# EAGLE design pico_tracker_v3.1 (EAGLE 6.4)
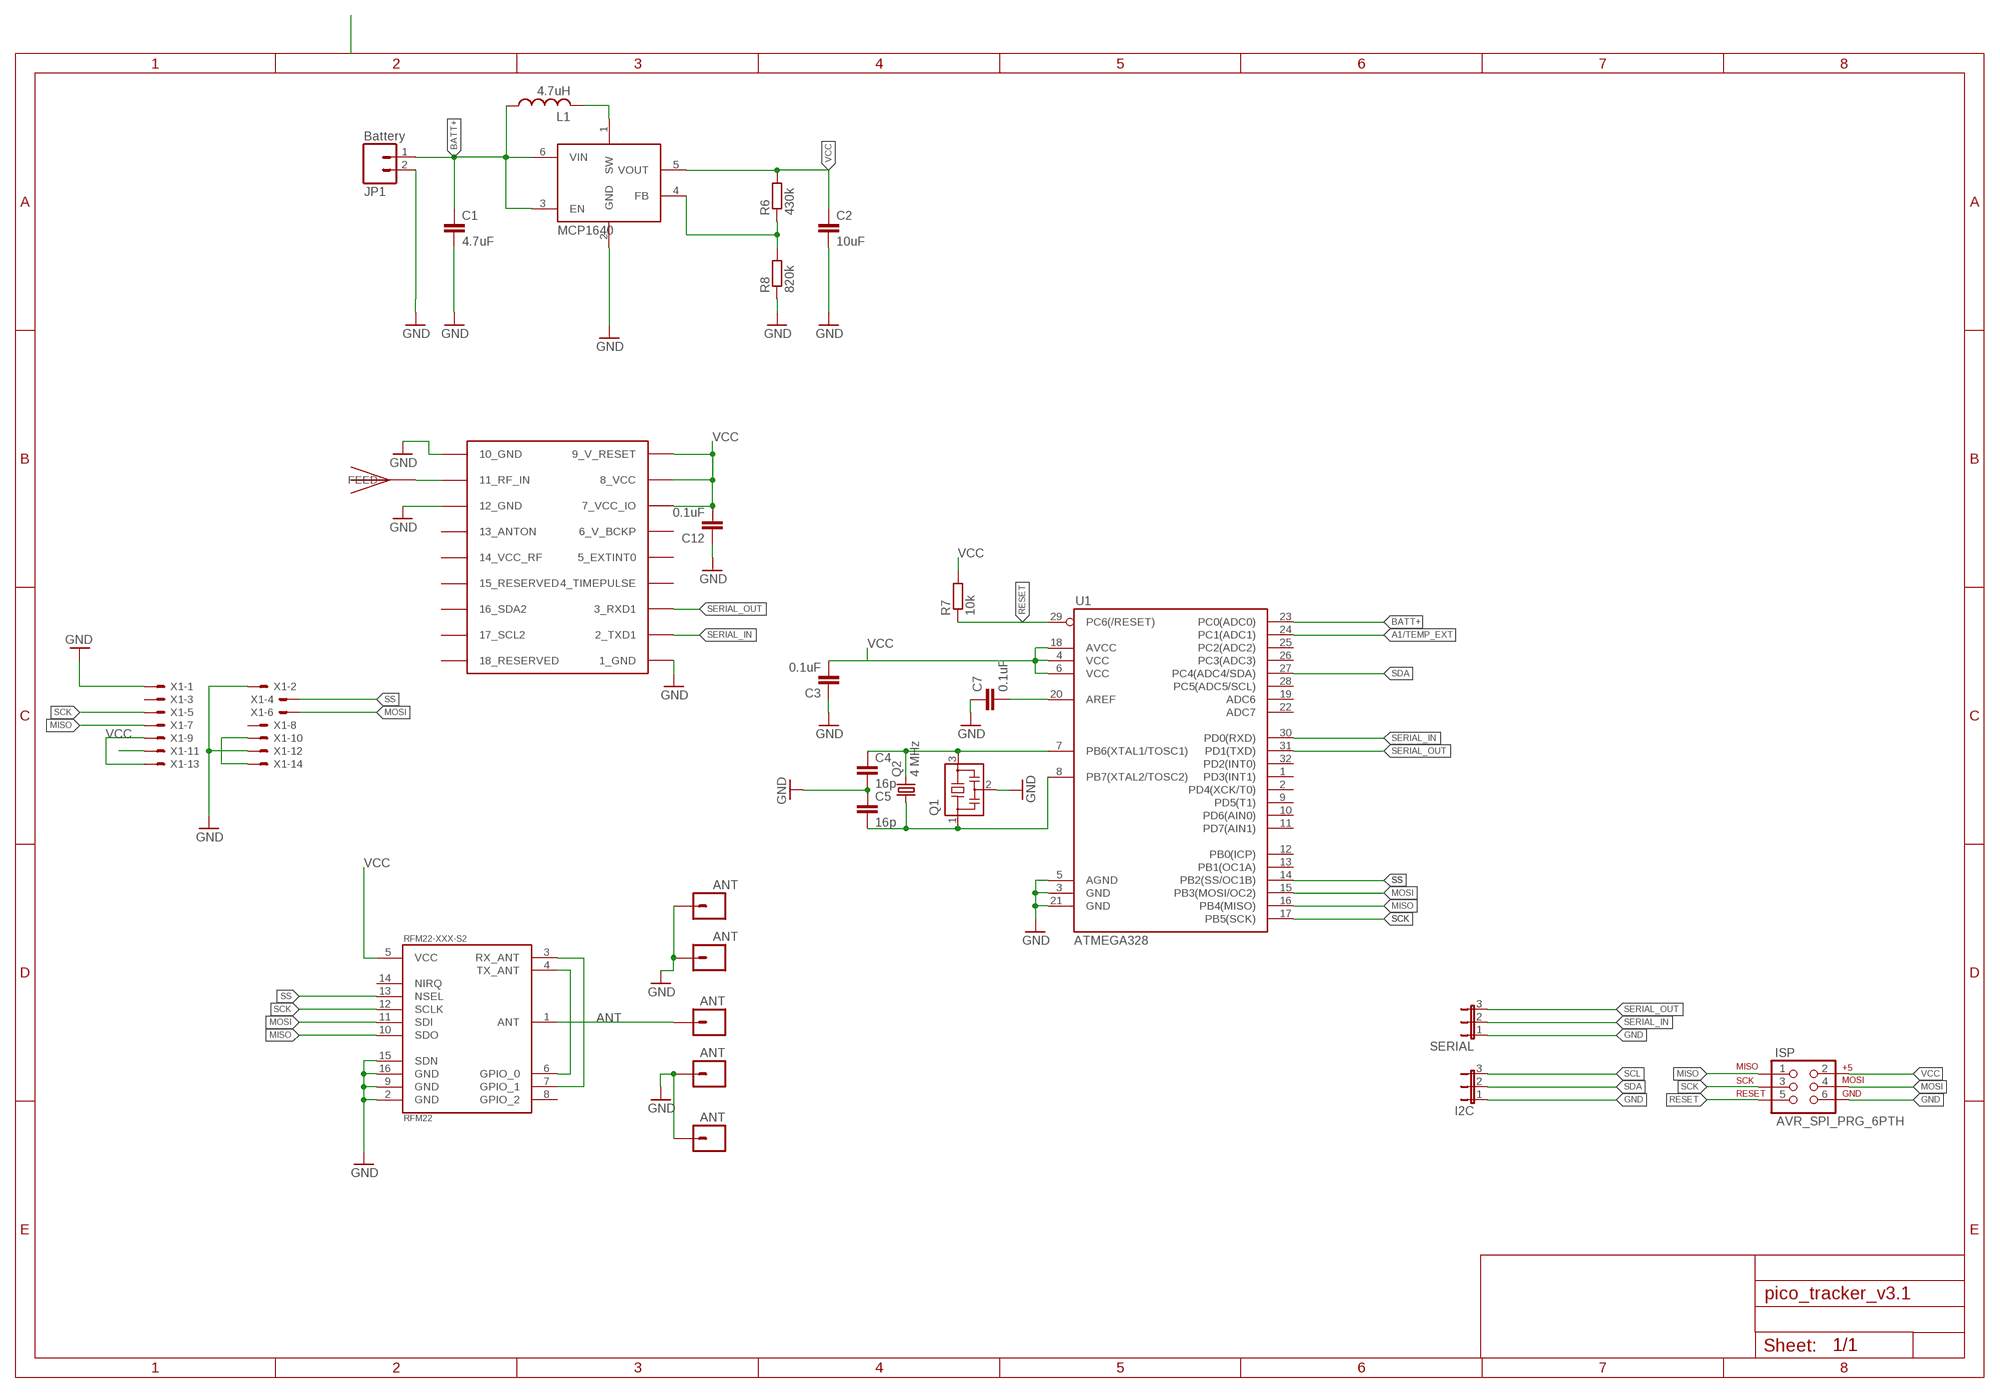
[diagram p0: schematic, sheet 1]

## Parts
C1  4.7uF  C-EUC0805  [C0805]
C2  10uF  C-EUC0805  [C0805]
C3  0.1uF  C-EUC0603  [C0603]
C4  16p  C-EUC0603  [C0603]
C5  16p  C-EUC0603  [C0603]
C7  0.1uF  C-EUC0603  [C0603]
C12  0.1uF  C-EUC0603  [C0603]
GND  ANT  M01PTH  [1X01]
GND17  ANT  M01PTH  [1X01]
GPS_ANT  JTI_ANTENNA-1575AT43A40  [JTI_ANTENNA-1575AT43A40]
I2C  JP2E  [JP2]
ISP  AVR_SPI_PRG_6PTH  [2X3]
JP1  Battery  M02PTH  [1X02]
JP2  ANT  M01PTH  [1X01]
JP3  ANT  M01PTH  [1X01]
JP4  ANT  M01PTH  [1X01]
L1  4.7uH  LLQH44P_P0  [LQH44]
Q1  CSTCR6M00G53Z  [CSTCR6M]
Q2  4 MHz  ABRACON_ABM3_CRYSTALABM03_HC49  [ABM03_HC49]
R6  430k  R-EU_R0603  [R0603]
R7  10k  R-EU_R0603  [R0603]
R8  820k  R-EU_R0603  [R0603]
RFM22-XXX-S2  RFM22  [RFM22-XXX-S2]
SERIAL  JP2E  [JP2]
U1  ATMEGA328  ATMEGA168  [TQFP32-08]
U2  MCP1640  [SOT23-6]
U$3  UBLOX_MAX-6  [UBLOX_MAX-6]
X1  87758-1416  [87758-1416]

## Nets
A1/TEMP_EXT: U1.24(PC1(ADC1))
ANT: JP2.1 RFM22-XXX-S2.1(ANT)
AREF: C7.2 U1.20(AREF)
BATT+ [vcc]: C1.1 JP1.1 L1.P$1 U1.23(PC0(ADC0)) U2.3(EN) U2.6(VIN)
GND: C1.2 C2.2 C3.1 C4.2 C5.1 C7.1 C12.1 GND17.1 GND.1 I2C.1 ISP.6 JP1.2 JP3.1 JP4.1 Q1.2 R8.1 RFM22-XXX-S2.2(GND) RFM22-XXX-S2.9(GND) RFM22-XXX-S2.15(SDN) RFM22-XXX-S2.16(GND) SERIAL.1 U1.3(GND) U1.5(AGND) U1.21(GND) U2.2(GND) U$3.1_GND U$3.10_GND U$3.12_GND X1.1 X1.2 X1.12
GPS_ANT: GPS_ANT.FEED U$3.11_RF_IN
MISO: ISP.1 RFM22-XXX-S2.10(SDO) U1.16(PB4(MISO)) X1.7
MOSI: ISP.4 RFM22-XXX-S2.11(SDI) U1.15(PB3(MOSI/OC2)) X1.6
N$2: X1.9 X1.13
N$3: X1.10 X1.14
N$6: RFM22-XXX-S2.4(TX_ANT) RFM22-XXX-S2.6(GPIO_0)
N$7: RFM22-XXX-S2.3(RX_ANT) RFM22-XXX-S2.7(GPIO_1)
N$8: L1.P$2 U2.1(SW)
N$9: C4.1 Q1.3 Q2.2 U1.7(PB6(XTAL1/TOSC1))
N$10: C5.2 Q1.1 Q2.1 U1.8(PB7(XTAL2/TOSC2))
N$11: R6.1 R8.2 U2.4(FB)
RESET: ISP.5 R7.1 U1.29(PC6(/RESET))
SCK: ISP.3 RFM22-XXX-S2.12(SCLK) U1.17(PB5(SCK)) X1.5
SCL: I2C.3
SDA: I2C.2 U1.27(PC4(ADC4/SDA))
SERIAL_IN: SERIAL.2 U1.30(PD0(RXD)) U$3.2_TXD1
SERIAL_OUT: SERIAL.3 U1.31(PD1(TXD)) U$3.3_RXD1
SS: RFM22-XXX-S2.13(NSEL) U1.14(PB2(SS/OC1B)) X1.4
VCC: C2.1 C3.2 C12.2 ISP.2 R6.2 R7.2 RFM22-XXX-S2.5(VCC) U1.4(VCC) U1.6(VCC) U1.18(AVCC) U2.5(VOUT) U$3.7_VCC_IO U$3.8_VCC U$3.9_V_RESET X1.11
Unconnected: RFM22-XXX-S2.8(GPIO_2) RFM22-XXX-S2.14(NIRQ) U1.1(PD3(INT1)) U1.2(PD4(XCK/T0)) U1.9(PD5(T1)) U1.10(PD6(AIN0)) U1.11(PD7(AIN1)) U1.12(PB0(ICP)) U1.13(PB1(OC1A)) U1.19(ADC6) U1.22(ADC7) U1.25(PC2(ADC2)) U1.26(PC3(ADC3)) U1.28(PC5(ADC5/SCL)) U1.32(PD2(INT0)) U$3.4_TIMEPULSE U$3.5_EXTINT0 U$3.6_V_BCKP U$3.13_ANTON U$3.14_VCC_RF U$3.15_RESERVED U$3.16_SDA2 U$3.17_SCL2 U$3.18_RESERVED X1.3 X1.8

## Library data of the parts
C1-C5 C7 C12 = resistor:C-EU: CAPACITOR, European symbol
GND GND17 JP2-JP4 = SparkFun:M01: Header 1 Standard 1-pin 0.1" header. Use with straight break away headers (SKU : PRT-00116), right angle break away headers (PRT-00553), swiss pins (PRT-00743), machine pins (PRT-00117), and female headers (PRT-00115).
GPS_ANT = ava:JTI_ANTENNA-1575AT43A40
I2C SERIAL = jumper:JP2E: JUMPER
ISP = SparkFun:AVR_SPI_PRG_6: AVR ISP 6 Pin This is the reduced ISP connector for AVR programming. Common on Arduino. This footprint will take up less PCB space and can be used with a 10-pin to 6-pin adapter such as SKU: BOB-08508
JP1 = SparkFun:M02: Header 2 Standard 2-pin 0.1" header. Use with straight break away headers (SKU : PRT-00116), right angle break away headers (PRT-00553), swiss pins (PRT-00743), machine pins (PRT-00117), and female headers (PRT-00115). Molex polarized connector foot print use with SKU : PRT-08233 with associated crimp pins and housings.
L1 = karlnet-parts:L
Q1 = murata-filter:CSTCR: Resonator Source: murata.co.jp; MPN: CSTCR6M00G53-R0; OC_FARNELL: 1170434; OC_NEWARK: 25M8759
Q2 = ava:ABRACON_ABM3_CRYSTAL
R6-R8 = resistor:R-EU_: RESISTOR, European symbol
RFM22-XXX-S2 = SparkFun:RFM22: *Hope RF's RFM22* Packages: RFM22-S2 (SMD)
U1 = SparkFun:ATMEGA168
U2 = karlnet-parts:MCP1640: MCP1623, 1624, 1640/B/C/D pwm/pfm or pwm only DC/DC converters, in SOT-23
U$3 = ava:UBLOX_MAX-6: UBLOX MAX-6
X1 = con-molex:87758-1416: 14 Pin - 2mm Dual Row Single Wafer, Vertical T/H HDR Source: http://www.molex.com/pdm_docs/sd/877580616_sd.pdf

## Net classes
0 default: width 0.254 mm, drill 0.508 mm, clearance 0.254 mm
1 vcc: width 0.254 mm

## Board
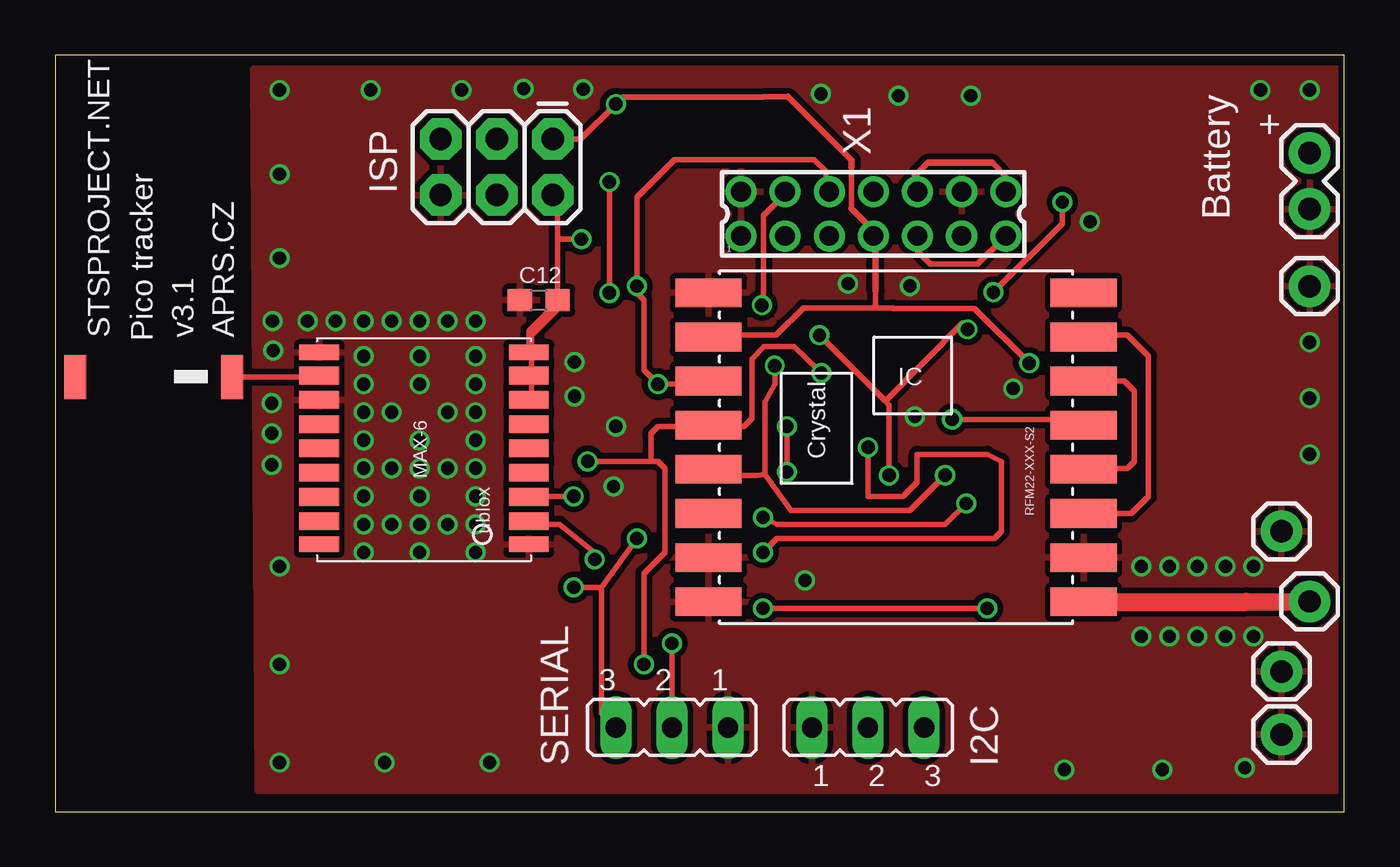
[diagram p1: board, top side]
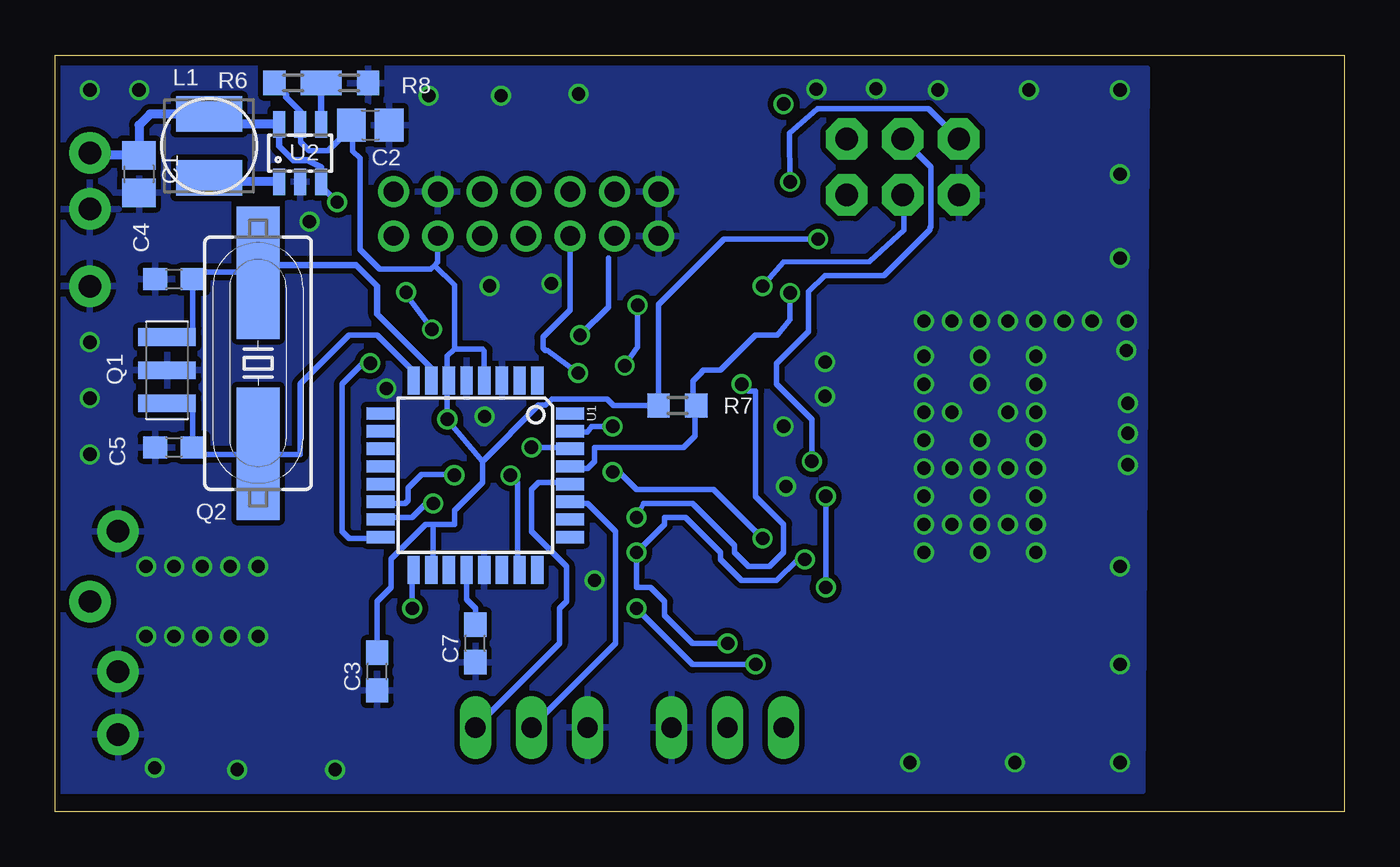
[diagram p2: board, bottom side, seen from below]

Size 58.41 x 34.28 mm. Coordinates in mm from the lower left corner, seen from the top.
Outline: 0,0 58.41,0 58.41,34.28 0,34.28 0,0
Copper layers (1*16): Top 0.035mm / dielectric 1.5mm / Bottom 0.035mm
Design rules "Fusion_eagle_rule_v1.1": minimum track width 6mil, minimum drill 12mil, track to track 6mil, track to pad 6mil, pad to pad 6mil, via to via 6mil, smd to smd 0mil, copper to edge 10mil, drill to drill 10mil, minimum pad ring 10mil, minimum via ring 6mil, stop-mask expansion 2mil, vias tented up to drill 100mil, thermal gap 10mil

### Footprints (pad centres in the part's own frame; a part is rotated, then mirrored left to right if it is on the bottom)
C0805 = smd 1.3 x 1.5: 1 -0.85,0; 2 0.85,0
C0603 = smd 1.1 x 1: 1 -0.85,0; 2 0.85,0
1X01 = drill 1.016 pad 1.88: 1 0,0
JTI_ANTENNA-1575AT43A40 = smd 1 x 2: FEED -3.81,-1.27; NC 3.29,-1.27
JP2 = drill 0.914 long: 1 -2.54,0; 2 0,0; 3 2.54,0
2X3 = drill 1.016 pad 1.88 octagon: 1 0,0; 2 0,2.54; 3 2.54,0; 4 2.54,2.54; 5 5.08,0; 6 5.08,2.54
1X02 = drill 1.016 pad 1.88: 1 0,0; 2 2.54,0
LQH44 = smd 1.6 x 3: P$1 -1.45,0; P$2 1.45,0
CSTCR6M = smd 0.8 x 2.6: 1 -1.5,0; 2 0,0; 3 1.5,0
ABM03_HC49 = smd 6 x 1.93: 1 -4.1,0; 2 4.1,0
R0603 = smd 1 x 1.1: 1 -0.85,0; 2 0.85,0
RFM22-XXX-S2 = smd 3 x 1.3: 1 -8.5,7; 2 -8.5,5; 3 -8.5,3; 4 -8.5,1; 5 -8.5,-1; 6 -8.5,-3; 7 -8.5,-5; 8 -8.5,-7; 9 8.5,-7; 10 8.5,-5; 11 8.5,-3; 12 8.5,-1; 13 8.5,1; 14 8.5,3; 15 8.5,5; 16 8.5,7
TQFP32-08 = smd 1.27 x 0.559: 1 -4.293,2.8; 2 -4.293,2; 3 -4.293,1.2; 4 -4.293,0.4; 5 -4.293,-0.4; 6 -4.293,-1.2; 7 -4.293,-2; 8 -4.293,-2.8; 17 4.293,-2.8; 18 4.293,-2; 19 4.293,-1.2; 20 4.293,-0.4; 21 4.293,0.4; 22 4.293,1.2; 23 4.293,2; 24 4.293,2.8 | smd 0.559 x 1.27: 9 -2.8,-4.293; 10 -2,-4.293; 11 -1.2,-4.293; 12 -0.4,-4.293; 13 0.4,-4.293; 14 1.2,-4.293; 15 2,-4.293; 16 2.8,-4.293; 25 2.8,4.293; 26 2,4.293; 27 1.2,4.293; 28 0.4,4.293; 29 -0.4,4.293; 30 -1.2,4.293; 31 -2,4.293; 32 -2.8,4.293
SOT23-6 = smd 0.55 x 1.2: 1 -0.95,-1.3; 2 0,-1.3; 3 0.95,-1.3; 4 0.95,1.3; 5 0,1.3; 6 -0.95,1.3
UBLOX_MAX-6 = smd 1.8 x 0.7: 1_GND 4.95,-4.4; 9_V_RESET 4.95,4.3; 10_GND -4.55,4.3; 18_RESERVED -4.55,-4.4 | smd 1.8 x 0.8: 2_TXD1 4.95,-3.35; 3_RXD1 4.95,-2.25; 4_TIMEPULSE 4.95,-1.15; 5_EXTINT0 4.95,-0.05; 6_V_BCKP 4.95,1.05; 7_VCC_IO 4.95,2.15; 8_VCC 4.95,3.25; 11_RF_IN -4.55,3.25; 12_GND -4.55,2.15; 13_ANTON -4.55,1.05; 14_VCC_RF -4.55,-0.05; 15_RESERVED -4.55,-1.15; 16_SDA2 -4.55,-2.25; 17_SCL2 -4.55,-3.35
87758-1416 = drill 0.9 pad 1.27: 1 -6,-1; 2 -6,1; 3 -4,-1; 4 -4,1; 5 -2,-1; 6 -2,1; 7 0,-1; 8 0,1; 9 2,-1; 10 2,1; 11 4,-1; 12 4,1; 13 6,-1; 14 6,1

### Placement (x,y rotation side)
C1  54.61,28.89 270 bottom
C2  44.13,31.11 0 bottom
C3  43.81,6.35 90 bottom
C4  53.02,24.13 180 bottom
C5  53.02,16.51 0 bottom
C7  39.37,7.62 90 bottom
C12  21.91,23.18 0 top
GND  55.56,6.35 0 top
GND17  56.83,23.81 0 top
GPS_ANT  4.2,18.42 180 top
I2C  36.83,3.81 0 top
ISP  22.54,30.48 180 top
JP1  56.83,29.85 270 top
JP2  56.83,9.52 0 top
JP3  55.56,12.7 0 top
JP4  55.56,3.49 0 top
L1  51.43,30.16 270 bottom
Q1  53.34,20 90 bottom
Q2  49.21,20.32 90 bottom
R6  47.62,33.02 180 bottom
R7  30.21,18.4 180 bottom
R8  45.08,33.02 180 bottom
RFM22-XXX-S2  38.1,16.51 180 top
SERIAL  27.94,3.81 180 top
U1  39.37,15.24 270 bottom
U2  47.31,29.85 0 bottom
U$3  16.51,16.51 0 top
X1  37.07,27.09 0 top

### Tracks (layer width: path | path; a pad name or v marks a point on that pad's centre or on a via)
ANT
  Top 0.813: RFM22-XXX-S2.1 53.96,9.51 JP2.1
AREF
  Bottom 0.254: U1.20 39.77,9.61 39.37,9.21 C7.2
BATT+  (via drill 0.6, 0.6 pad 0.25)
  Top 0.254: v37.78,15.24 37.78,18.41 37.61,18.61 | v34.63,21.59 37.61,18.61 | v45.63,27.62 45.63,26.66 v42.51,23.53 | v41.34,21.86 41.11,22.14 37.61,18.61
  Bottom 0.254: v37.78,15.24 37.46,14.92 37.46,11.11 U1.23 | v34.63,21.59 33.34,22.86 33.34,25.08 | U2.3 46.36,28.35 v45.63,27.62 | v42.51,23.53 42.51,23.43 v41.34,21.86
  Bottom 0.305: U2.3 46.36,29.21 46.99,29.53 47.63,29.53 48.26,30.16 U2.6
  Bottom 0.406: U2.6 50.97,31.15 L1.P$1 54.11,31.61 54.61,31.11 C1.1 56.73,29.74 JP1.1
GND  (via drill 0.6, 0.6 pad 0.25)
  other vias: 13.97,20.64 9.87,20.89 9.81,18.51 13.97,19.37 13.97,18.1 13.97,16.83 13.97,15.56 13.97,14.29 13.97,13.02 16.51,11.75 19.05,11.75 15.24,13.02 15.24,15.56 15.24,18.1 16.51,13.02 16.51,14.29 16.51,15.56 16.51,16.83 16.51,19.37 16.51,20.64 17.78,13.02 19.05,13.02 17.78,15.56 17.78,18.1 19.05,14.29 19.05,15.56 19.05,16.83 19.05,18.1 19.05,19.37 19.05,20.64 9.81,17.14 9.81,15.72 9.84,22.22 11.43,22.22 12.7,22.22 13.97,22.22 15.24,22.22 16.51,22.22 17.78,22.22 19.05,22.22 38.96,17.91 23.53,18.82 49.21,11.11 50.48,11.11 51.75,11.11 49.21,7.94 50.48,7.94 51.75,7.94 21.22,32.77 53.02,11.11 53.02,7.94 54.29,11.11 54.29,7.94 13.97,11.75 33.97,10.48 23.93,32.74 35.93,23.93 38.72,23.83 34.7,32.52 38.2,32.45 41.48,32.45 10.16,32.7 10.16,28.89 10.16,25.08 14.29,32.7 18.41,32.7 53.9,1.98 54.61,32.7 10.16,11.11 10.16,6.67 10.16,2.22 14.92,2.22 19.69,2.22 50.16,1.9 45.72,1.9 25.4,17.46 25.3,14.73 43.4,19.18 56.83,32.7 56.83,21.27 56.83,18.73 56.83,16.19 46.89,26.73 23.52,20.37
  pour Bottom: 8.95,33.69 58.1,33.66 58.1,0.95 9.14,0.92
  pour Top: 8.97,33.67 58.1,33.66 58.1,0.95 9.16,0.93
GPS_ANT
  Top 0.254: GPS_ANT.FEED 8.89,19.68 11.75,19.68 U$3.11_RF_IN
MISO  (via drill 0.6, 0.6 pad 0.25)
  Top 0.254: RFM22-XXX-S2.10 29.85,21.59 32.66,21.59 33.9,22.82 37.07,22.82 | 36.08,27.32 36.08,29.2 | 33.21,32.4 32.08,32.4 32.07,32.39 25.72,32.39 v25.4,32.07 23.81,30.48 ISP.1 | 37.07,22.82 37.96,22.82 37.99,22.8 41.66,22.8 v44.13,20.32 | 37.17,23.61 37.17,22.92 37.07,22.82
  Top 0.305: v44.13,20.32 43.79,20.32 | 37.17,23.61 37.17,25.99 X1.7 37.07,26.33 36.08,27.32 | 36.08,29.2 36.08,29.53 33.21,32.4
  Bottom 0.254: 43.82,12.38 U1.16 43.72,12.38 45.08,12.38 45.4,12.7 45.4,19.37 44.45,20.32 v44.13,20.32
MOSI  (via drill 0.6)
  Top 0.254: RFM22-XXX-S2.11 29.53,19.37 v27.31,19.37 26.67,20 26.67,23.18 26.35,23.5 v26.35,23.81 26.35,27.85 28.05,29.55 34.38,29.55 34.91,29.02 34.91,28.25 X1.6 | v32.07,13.34 32.7,13.02 40.32,13.02 v41.28,13.97
  Bottom 0.254: v26.35,23.81 25.4,24.89 21.51,24.92 19.95,26.35 19.95,27.89 ISP.4 | v32.07,13.34 31.75,13.97 29.53,13.97 27.62,12.06 27.62,11.75 26.99,11.11 26.03,11.11 25.4,11.75 25.4,13.02 26.67,14.29 26.67,19.05 26.99,19.05 v27.31,19.37 | v41.28,13.97 41.59,13.97 42.23,13.34 43.5,13.34 U1.15
N$2
  Top 0.254: X1.9 39.07,25.39 39.66,24.8 41.79,24.8 X1.13
N$3
  Top 0.254: 42.46,29.4 43.12,28.74 43.12,28.13 X1.14
  Top 0.305: 42.46,29.4 39.54,29.4 38.95,28.82 38.95,28.21 X1.10
N$6
  Top 0.254: RFM22-XXX-S2.6 48.43,19.51 48.89,19.05 48.89,15.88 48.58,15.56 46.99,15.56 46.67,15.24 | 46.67,15.24 46.67,15.56 | RFM22-XXX-S2.4 46.6,15.31 46.67,15.24
N$7
  Top 0.254: RFM22-XXX-S2.3 48.75,13.51 49.53,14.29 49.53,20.64 48.58,21.59 46.67,21.59 | 46.67,21.59 46.67,21.27 46.35,21.27 RFM22-XXX-S2.7 | RFM22-XXX-S2.7 | RFM22-XXX-S2.7 46.67,21.59
N$8
  Bottom 0.406: U2.1 51.46,28.54 51.75,28.26 51.75,28.4 L1.P$2
N$9
  Bottom 0.254: U1.7 | Q2.2 49.21,24.45 51.75,24.45 52.07,24.13 C4.1 52.17,21.5 Q1.3
  Bottom 0.305: U1.7 41.37,20.1 43.82,22.54 43.82,23.81 44.77,24.76 48.87,24.76 Q2.2
N$10
  Bottom 0.254: U1.8 42.17,19.95 43.82,21.59 45.08,21.59 47.31,19.37 47.31,16.19 49.21,16.19 | 49.21,16.19 51.85,16.19 C5.2 52.17,18.5 Q1.1 | Q2.1 49.21,16.19
N$11
  Bottom 0.254: R6.1 R8.2
  Bottom 0.305: U2.4 46.36,32.6 R8.2
RESET  (via drill 0.6)
  Top 0.254: v25.11,23.51 v25.11,28.54
  Bottom 0.254: U1.29 34.93,15.56 34.29,15.56 33.97,15.88 33.97,16.51 29.95,16.51 29.43,17.03 29.43,18.34 R7.1 29.5,18.54 29.5,19.52 29.12,19.9 29.12,19.93 29.04,20 28.26,20 26.67,21.59 25.68,21.59 25.11,22.29 v25.11,23.51 | 17.45,30.47 ISP.5 18.85,31.86 23.86,31.86 25.13,30.75 v25.11,28.54
SCK  (via drill 0.6, 0.6 pad 0.25)
  Top 0.254: v32.07,9.21 v42.23,9.21 | v26.67,6.67 26.67,10.79 27.62,11.75 27.62,15.56 27.31,15.88 26.99,15.88 | 26.99,15.88 v24.13,15.88 | 26.99,15.88 26.99,17.15 27.31,17.46 29.53,17.46 RFM22-XXX-S2.12 30.48,17.78 30.8,17.46 31.2,17.46 31.56,17.82 31.56,20.51 32.12,21.07 33.46,21.07 34.58,20 v34.71,19.88
  Bottom 0.254: v42.23,9.21 42.23,10.79 U1.17 | v26.67,6.67 29.53,6.67 v32.07,9.21 | v24.13,15.88 24.13,17.78 25.72,19.37 25.72,20.31 24.27,21.76 24.27,23.56 23.53,24.3 20.87,24.3 18.78,26.38 18.78,26.45 18.73,26.5 18.73,29.21 ISP.3 | X1.5 35.07,22.74 36.31,21.5 36.31,21.02 36.18,20.89 36.11,20.89 v34.71,19.88
SCL
  Bottom 0.254: 35.24,14.92 36.51,14.92 36.83,14.61 36.83,12.7 35.24,11.11 35.24,9.52 35.56,9.21 35.56,7.62 I2C.3
SDA
  Bottom 0.254: I2C.2 33.02,7.62 33.02,12.7 34.29,13.97 35.56,13.97 U1.27
SERIAL_IN  (via drill 0.6 pad 0.25)
  Top 0.254: v27.94,7.62 SERIAL.2 | v24.45,11.43 24.45,11.75 22.86,13.02 21.59,13.02 U$3.2_TXD1 | v32.07,11.75 32.7,12.38 42.54,12.38 42.86,12.7 42.86,15.88 42.23,16.19 39.05,16.19 39.05,14.92 38.42,14.29 36.83,14.29 v36.83,16.51
  Bottom 0.254: v36.83,16.51 35.24,16.51 U1.30 | v27.94,7.62 29.53,7.62 30.8,8.89 30.8,9.52 31.43,10.16 32.07,10.16 v32.07,11.75 30.8,13.02 30.8,13.34 29.85,13.34 28.26,11.75 28.26,11.43 27.31,10.48 25.72,10.48 24.76,11.43 v24.45,11.43
SERIAL_OUT  (via drill 0.6 pad 0.25)
  Top 0.254: 24.76,10.16 v23.5,10.16 | v26.35,12.38 24.76,10.16 | v23.5,14.29 21.59,14.29 U$3.3_RXD1 | 24.76,10.16 24.76,4.44 SERIAL.3 | v33.15,15.39 v33.15,17.46
  Bottom 0.254: v23.5,10.16 v23.5,14.29 | v26.35,12.38 28.57,14.61 32.07,14.61 33.02,15.56 v33.15,15.39 | v33.15,17.46 34.11,17.46 34.29,17.21 35.05,17.21 U1.31
SS  (via drill 0.6, 0.61)
  Top 0.254: RFM22-XXX-S2.13 30.48,15.24 31.75,15.24 32.17,15.28 | v40.32,15.24 38.74,13.65 33.34,13.65 32.17,15.28 | 32.96,28.26 33.07,28.14 X1.4 33.07,27.99 32.09,27.01 32.09,23.03 v32.02,22.95 | v32.6,20.21 32.6,19.37 32.17,18.55 32.17,15.28
  Bottom 0.254: U1.14 43.18,13.97 42.54,13.97 42.42,14.1 42.42,14.67 41.81,15.27 40.35,15.27 v40.32,15.24 | v32.02,22.95 32.02,21.04 v32.6,20.21
VCC  (via drill 0.6, 0.61)
  Top 0.254: 21.59,20.64 21.59,20 | 21.59,20.64 U$3.9_V_RESET 21.46,21.78 22.86,23.18 | 21.59,20 21.91,19.68 21.59,19.37 21.59,18.73 U$3.7_VCC_IO | 21.59,20 U$3.8_VCC | v40.64,17.78 45.72,17.78 RFM22-XXX-S2.5 | 21.59,20.64 21.59,21.59 22.86,22.86 C12.2 22.76,26.05 | 22.76,26.05 22.76,27.72 ISP.2 | v23.84,25.95 22.86,25.95 22.76,26.05
  Bottom 0.254: 39.05,15.88 v40.64,17.78 40.64,19.05 U1.6 40.64,19.6 40.64,20.64 40.32,20.96 | U1.4 38.97,20.87 39.05,20.96 40.32,20.96 | 41.28,10.79 U1.18 41.28,11.11 41.28,13.02 | C3.2 43.82,9.52 43.18,10.16 43.18,11.46 41.62,13.02 41.28,13.02 | 39.05,15.88 36.51,18.41 36.2,18.41 35.9,18.71 33.41,18.71 33.11,18.4 R7.2 31.06,22.99 28.11,25.95 v23.84,25.95 | 39.05,15.88 39.05,14.92 40.32,13.65 40.32,13.02 41.28,13.02 | X1.11 41.07,24.89 41.21,24.75 | 41.21,24.75 41.39,24.57 43.7,24.57 44.59,25.46 44.59,29.6 44.92,29.93 44.92,31.05 C2.1 44.98,31.01 46.04,29.96 46.9,29.96 47.28,30.34 47.28,31.12 U2.5 | 40.32,20.96 40.32,23.86 41.21,24.75
  Bottom 0.305: U2.5 47.31,31.75 47.94,32.39 47.94,32.49 R6.2

### Text on the board
tPlace: STSPROJECT.NET | v3.1 | APRS.CZ | Pico tracker
tNames: +